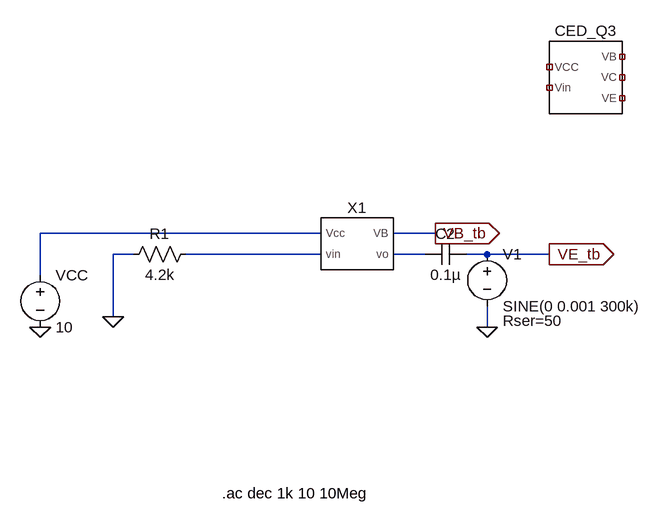
[diagram p0: schematic dp1_rout_testbench copy.asc]
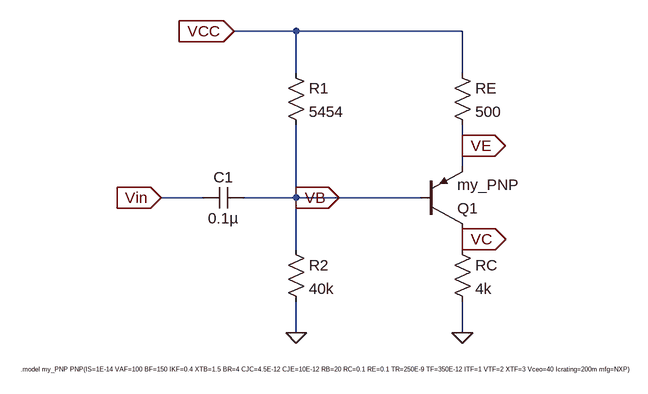
[diagram p1: sub-circuit ced_pnp_q3.asc]
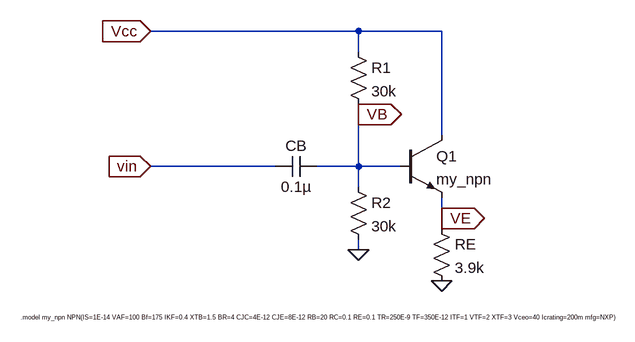
[diagram p2: sub-circuit ef_npn_q4.asc]
dp1_rout_testbench copy.asc, the LTspice schematic file:
Version 4
SHEET 1 2800 1584
WIRE 336 272 -96 272
WIRE 512 272 448 272
WIRE 48 304 16 304
WIRE 336 304 128 304
WIRE 496 304 448 304
WIRE 592 304 560 304
WIRE 688 304 592 304
WIRE -96 336 -96 272
WIRE 16 400 16 304
WIRE 592 416 592 384
FLAG -96 416 0
FLAG 512 272 VB_tb
IOPIN 512 272 Out
FLAG 688 304 VE_tb
IOPIN 688 304 Out
FLAG 16 400 0
FLAG 592 416 0
SYMBOL voltage -96 320 R0
SYMATTR InstName VCC
SYMATTR Value 10
SYMBOL CED_pnp_Q3 736 32 R0
SYMATTR InstName CED_Q3
SYMBOL Voltage 592 288 R0
WINDOW 39 24 118 Left 2
SYMATTR SpiceLine Rser=50
SYMATTR InstName V1
SYMATTR Value SINE(0 0.001 300k)
SYMATTR Value2 AC 1
SYMBOL Res 144 288 R90
WINDOW 0 0 56 VBottom 2
WINDOW 3 32 56 VTop 2
SYMATTR InstName R1
SYMATTR Value 4.2k
SYMBOL Cap 560 288 R90
WINDOW 0 0 32 VBottom 2
WINDOW 3 32 32 VTop 2
SYMATTR InstName C2
SYMATTR Value 0.1µ
SYMBOL EF_NPN_Q4 384 288 R0
SYMATTR InstName X1
TEXT 184 672 Left 2 !.ac dec 1k 10 10Meg

ced_pnp_q3.asc, the sub-circuit schematic file:
Version 4
SHEET 1 2272 688
WIRE 208 32 112 32
WIRE 464 32 208 32
WIRE 208 96 208 32
WIRE 464 96 464 32
WIRE 464 208 464 176
WIRE 464 240 464 208
WIRE 64 288 0 288
WIRE 208 288 208 176
WIRE 208 288 128 288
WIRE 400 288 208 288
WIRE 464 352 464 336
WIRE 208 368 208 288
WIRE 464 368 464 352
WIRE 208 496 208 448
WIRE 464 496 464 448
FLAG 208 496 0
FLAG 464 496 0
FLAG 0 288 Vin
IOPIN 0 288 In
FLAG 208 288 VB
IOPIN 208 288 Out
FLAG 464 208 VE
IOPIN 464 208 Out
FLAG 464 352 VC
IOPIN 464 352 Out
FLAG 112 32 VCC
IOPIN 112 32 In
SYMBOL Res 192 80 R0
SYMATTR InstName R1
SYMATTR Value 5454
SYMBOL Res 192 352 R0
SYMATTR InstName R2
SYMATTR Value 40k
SYMBOL Res 448 80 R0
SYMATTR InstName RE
SYMATTR Value 500
SYMBOL Cap 128 272 R90
WINDOW 0 0 32 VBottom 2
WINDOW 3 32 32 VTop 2
SYMATTR InstName C1
SYMATTR Value 0.1µ
SYMBOL Res 448 352 R0
SYMATTR InstName RC
SYMATTR Value 4k
SYMBOL pnp 400 336 M180
SYMATTR InstName Q1
SYMATTR Value my_PNP
TEXT -216 552 Left 0 !.model my_PNP PNP(IS=1E-14 VAF=100 BF=150 IKF=0.4 XTB=1.5 BR=4 CJC=4.5E-12 CJE=10E-12 RB=20 RC=0.1 RE=0.1 TR=250E-9 TF=350E-12 ITF=1 VTF=2 XTF=3 Vceo=40 Icrating=200m mfg=NXP)

ef_npn_q4.asc, the sub-circuit schematic file:
Version 4
SHEET 1 2800 760
WIRE 352 144 32 144
WIRE 480 144 352 144
WIRE 352 176 352 144
WIRE 352 272 352 256
WIRE 480 304 480 144
WIRE 224 352 32 352
WIRE 352 352 352 272
WIRE 352 352 288 352
WIRE 416 352 352 352
WIRE 352 384 352 352
WIRE 480 432 480 400
WIRE 480 448 480 432
WIRE 352 480 352 464
FLAG 480 528 0
FLAG 352 480 0
FLAG 480 432 VE
IOPIN 480 432 Out
FLAG 352 272 VB
IOPIN 352 272 Out
FLAG 32 144 Vcc
IOPIN 32 144 In
FLAG 32 352 vin
IOPIN 32 352 In
SYMBOL npn 416 304 R0
SYMATTR InstName Q1
SYMATTR Value my_npn
SYMBOL Res 464 432 R0
SYMATTR InstName RE
SYMATTR Value 3.9k
SYMBOL Res 336 160 R0
SYMATTR InstName R1
SYMATTR Value 30k
SYMBOL Res 336 368 R0
SYMATTR InstName R2
SYMATTR Value 30k
SYMBOL Cap 288 336 R90
WINDOW 0 0 32 VBottom 2
WINDOW 3 32 32 VTop 2
SYMATTR InstName CB
SYMATTR Value 0.1µ
TEXT -168 584 Left 0 !.model my_npn NPN(IS=1E-14 VAF=100 Bf=175 IKF=0.4 XTB=1.5 BR=4 CJC=4E-12 CJE=8E-12 RB=20 RC=0.1 RE=0.1 TR=250E-9 TF=350E-12 ITF=1 VTF=2 XTF=3 Vceo=40 Icrating=200m mfg=NXP)

The netlist it stands for:
* dp1_rout_testbench copy.asc
VCC N001 0 10
XCED_Q3 NC_01 NC_02 NC_03 NC_04 NC_05 ced_pnp_q3
V1 VE_tb 0 SINE(0 0.001 300k) AC 1 Rser=50
R1 N002 0 4.2k
C2 VE_tb N003 0.1µ
XX1 N001 N002 VB_tb N003 ef_npn_q4

* block symbol definitions
.subckt ced_pnp_q3 VCC Vin VB VC VE
R1 VCC VB 5454
R2 VB 0 40k
RE VCC VE 500
C1 VB Vin 0.1µ
RC VC 0 4k
Q1 VC VB VE 0 my_PNP
.model my_PNP PNP(IS=1E-14 VAF=100 BF=150 IKF=0.4 XTB=1.5 BR=4 CJC=4.5E-12 CJE=10E-12 RB=20 RC=0.1 RE=0.1 TR=250E-9 TF=350E-12 ITF=1 VTF=2 XTF=3 Vceo=40 Icrating=200m mfg=NXP)
.ends ced_pnp_q3

.subckt ef_npn_q4 Vcc vin VB vo
Q1 Vcc VB VE 0 my_npn
RE VE 0 3.9k
R1 Vcc VB 30k
R2 VB 0 30k
CB VB vin 0.1µ
.model my_npn NPN(IS=1E-14 VAF=100 Bf=175 IKF=0.4 XTB=1.5 BR=4 CJC=4E-12 CJE=8E-12 RB=20 RC=0.1 RE=0.1 TR=250E-9 TF=350E-12 ITF=1 VTF=2 XTF=3 Vceo=40 Icrating=200m mfg=NXP)
.ends ef_npn_q4

.model NPN NPN
.model PNP PNP
.lib standard.bjt
.ac dec 1k 10 10Meg
.backanno
.end